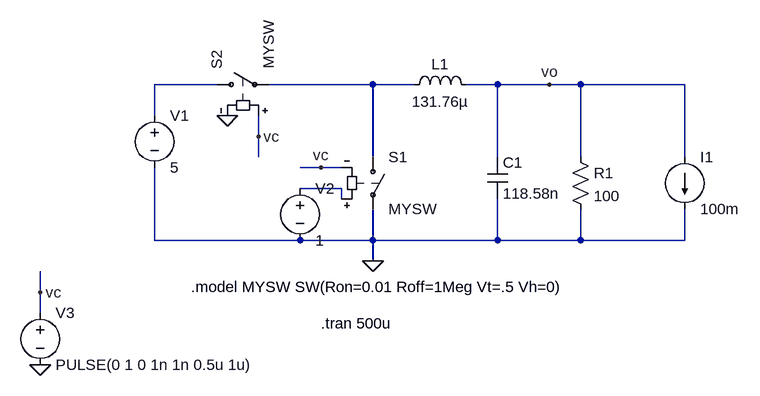
[diagram p0: schematic buck_open.asc]
buck_open.asc, the LTspice schematic file:
Version 4
SHEET 1 880 680
WIRE -144 -16 -240 -16
WIRE 96 -16 -64 -16
WIRE 160 -16 96 -16
WIRE 288 -16 240 -16
WIRE 368 -16 288 -16
WIRE 416 -16 368 -16
WIRE 576 -16 416 -16
WIRE -240 32 -240 -16
WIRE -80 64 -80 32
WIRE -80 96 -80 64
WIRE 96 96 96 -16
WIRE 288 96 288 -16
WIRE 416 96 416 -16
WIRE 576 96 576 -16
WIRE 16 112 -16 112
WIRE 48 112 16 112
WIRE 48 144 -16 144
WIRE 48 160 48 144
WIRE -240 224 -240 112
WIRE -16 224 -240 224
WIRE 96 224 96 176
WIRE 96 224 -16 224
WIRE 288 224 288 160
WIRE 288 224 96 224
WIRE 416 224 416 176
WIRE 416 224 288 224
WIRE 576 224 576 176
WIRE 576 224 416 224
WIRE 96 256 96 224
WIRE -416 304 -416 272
WIRE -416 336 -416 304
FLAG -128 32 0
FLAG 96 256 0
FLAG -80 64 vc
FLAG 16 112 vc
FLAG -416 304 vc
FLAG -416 416 0
FLAG 368 -16 vo
SYMBOL sw 96 80 R0
SYMATTR InstName S1
SYMATTR Value MYSW
SYMBOL sw -160 -16 R270
SYMATTR InstName S2
SYMATTR Value MYSW
SYMBOL voltage -240 16 R0
WINDOW 123 0 0 Left 0
WINDOW 39 0 0 Left 0
SYMATTR InstName V1
SYMATTR Value 5
SYMBOL ind 144 0 R270
WINDOW 0 32 56 VTop 2
WINDOW 3 5 56 VBottom 2
SYMATTR InstName L1
SYMATTR Value 131.76µ
SYMBOL cap 272 96 R0
SYMATTR InstName C1
SYMATTR Value 118.58n
SYMBOL res 400 80 R0
SYMATTR InstName R1
SYMATTR Value 100
SYMBOL voltage -16 128 R0
WINDOW 123 0 0 Left 0
WINDOW 39 0 0 Left 0
SYMATTR InstName V2
SYMATTR Value 1
SYMBOL voltage -416 320 R0
WINDOW 123 0 0 Left 0
WINDOW 39 0 0 Left 0
SYMATTR InstName V3
SYMATTR Value PULSE(0 1 0 1n 1n 0.5u 1u)
SYMBOL current 576 96 R0
WINDOW 123 0 0 Left 0
WINDOW 39 0 0 Left 0
SYMATTR InstName I1
SYMATTR Value 100m
TEXT -184 296 Left 2 !.model MYSW SW(Ron=0.01 Roff=1Meg Vt=.5 Vh=0)
TEXT 16 352 Left 2 !.tran 500u

The netlist it stands for:
* buck_open.asc
S1 N002 0 N003 vc MYSW
S2 N001 N002 vc 0 MYSW
V1 N001 0 5
L1 N002 vo 131.76µ
C1 vo 0 118.58n
R1 vo 0 100
V2 N003 0 1
V3 vc 0 PULSE(0 1 0 1n 1n 0.5u 1u)
I1 vo 0 100m
.model MYSW SW(Ron=0.01 Roff=1Meg Vt=.5 Vh=0)
.tran 500u
.backanno
.end